# EAGLE design AzizCanHAMASOGLU (EAGLE 9.6.2)
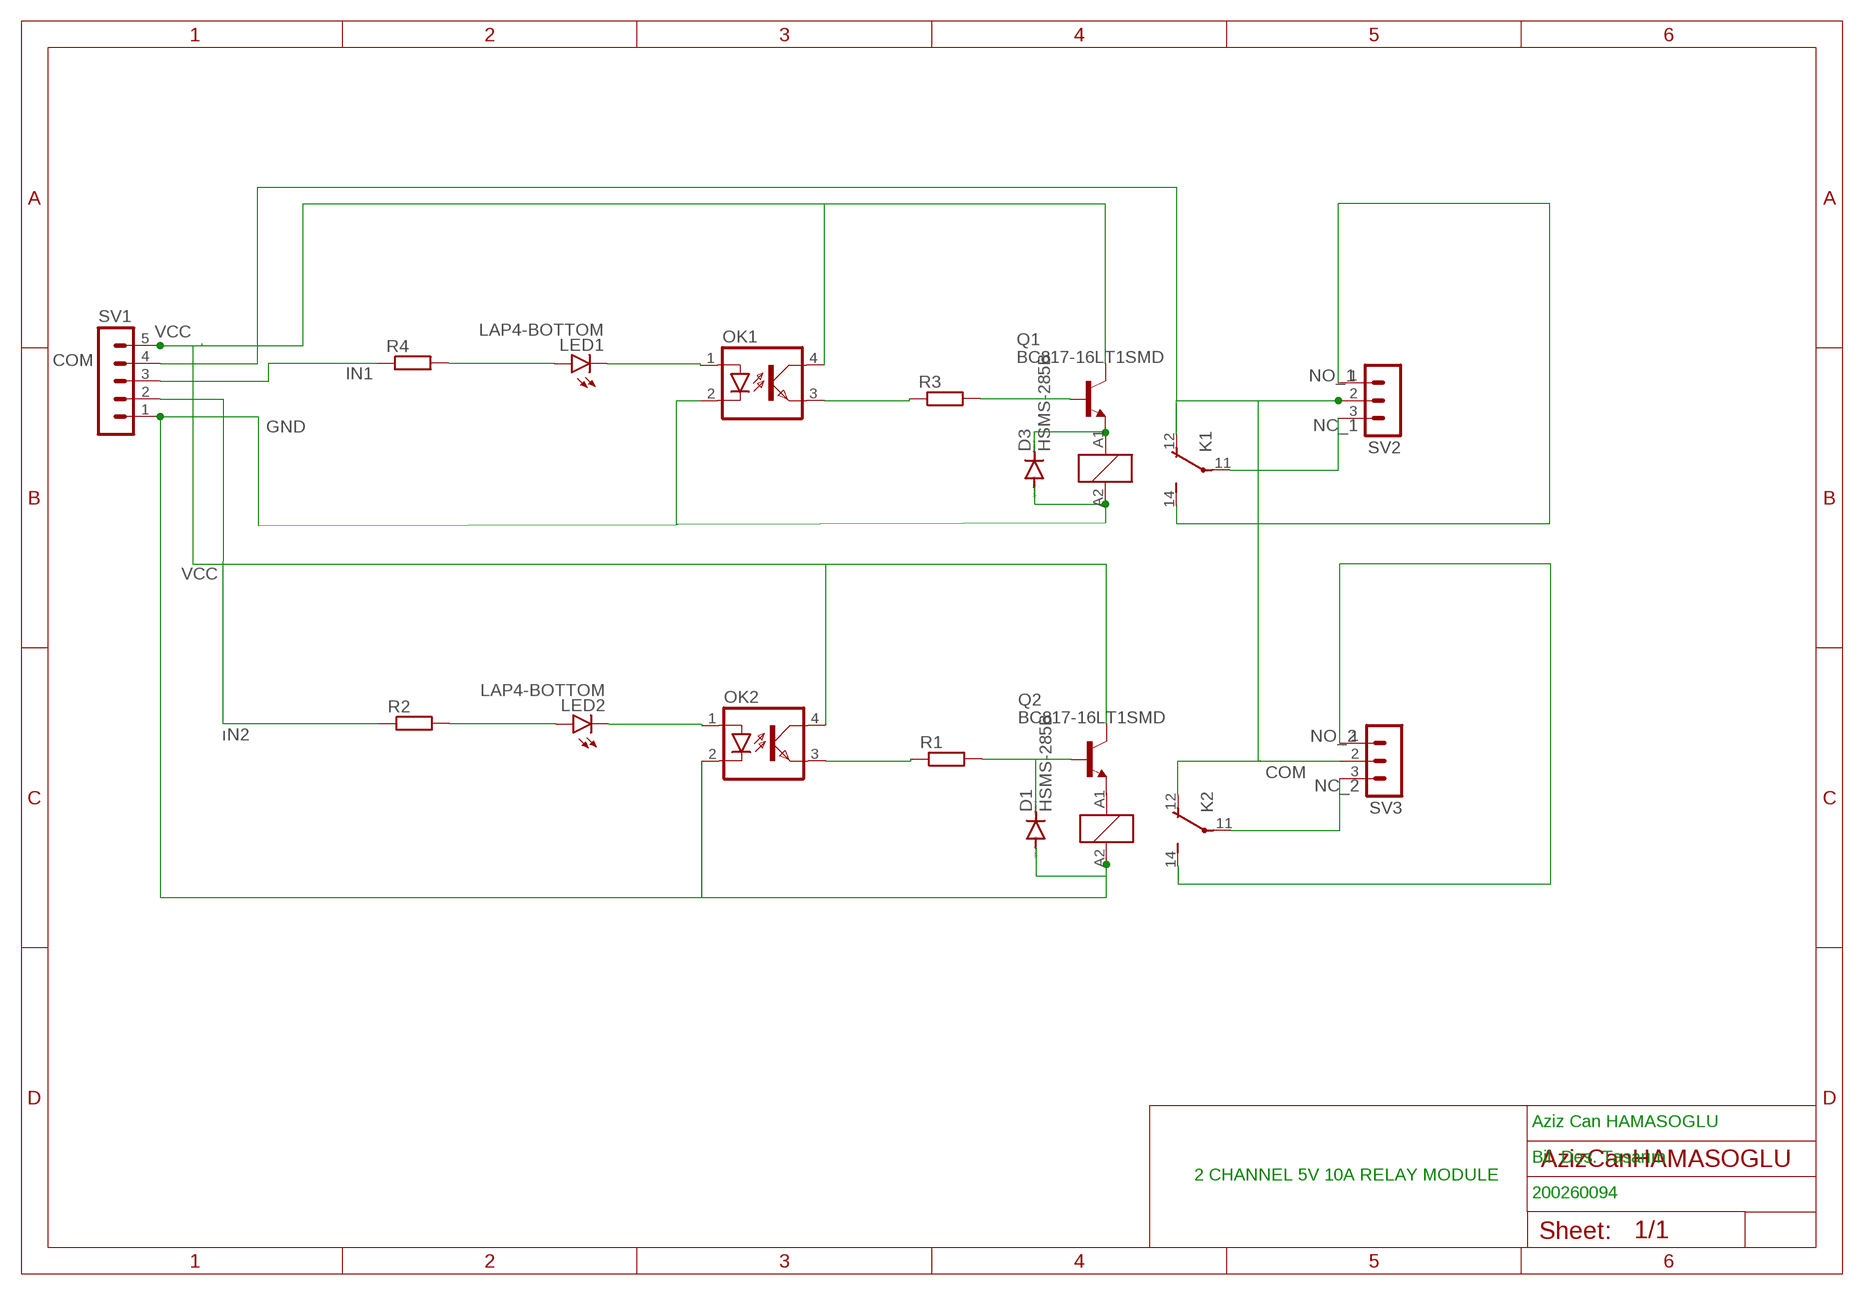
[diagram p0: schematic, sheet 1]

## Parts
D1  HSMS-285B  [SOT323]
D3  HSMS-285B  [SOT323]
K1  RY210005  [RY-II]
K2  RY210005  [RY-II]
LED1  LAP4-BOTTOM  [P47F-BOTTOM]
LED2  LAP4-BOTTOM  [P47F-BOTTOM]
OK1  PC817  [DIL04]
OK2  PC817  [DIL04]
Q1  BC817-16LT1SMD  [SOT23-BEC]
Q2  BC817-16LT1SMD  [SOT23-BEC]
R1  R-EU_M1206  [M1206]
R2  R-EU_M1206  [M1206]
R3  R-EU_M1206  [M1206]
R4  R-EU_M1206  [M1206]
SV1  MA05-1  [MA05-1]
SV2  MA03-1  [MA03-1]
SV3  MA03-1  [MA03-1]

## Nets
COM: K1.12(2:O) SV1.4 SV2.2 SV3.2
GND: D1.1(A) D3.1(A) K1.A2 K2.A2 OK1.2(C) OK2.2(C) SV1.1
IN1: R4.1 SV1.3
N$1: OK1.3(EMIT) R3.1
N$2: LED1.C OK1.1(A)
N$3: Q1.B R3.2
N$4: LED1.A R4.2
N$6: D3.3(C) K1.A1 Q1.E
N$7: OK2.3(EMIT) R1.1
N$8: D1.3(C) Q2.B R1.2
N$9: LED2.C OK2.1(A)
N$10: LED2.A R2.2
N$12: K2.12(2:O)
NC_1: K1.11(2:P) SV2.3
NC_2: K2.11(2:P) SV3.3
NO_1: K1.14(2:S) SV2.1
NO_2: K2.14(2:S) SV3.1
VCC: OK1.4(COL) OK2.4(COL) Q1.C Q2.C SV1.5
ıN2: R2.1 SV1.2
Unconnected: K2.A1 Q2.E

## Notes on the sheet
- Aziz Can HAMASOGLU
- Bil. Des. Tasarım
- 2 CHANNEL 5V 10A RELAY MODULE
- 200260094

## Library data of the parts
D1 D3 = avago:HSMS-285B: Surface Mount Microwave Schottky Detector Diodes Source: Data sheet <http://www.farnell.com/datasheets/461166.pdf>
K1 K2 = relay:RY?1*: Miniature Power PCB Relay SCHRACK 1 pole 8 A Source: http://www.schrack.com/.. 5817.pdf; MF: TYCO ELECTRONICS; MPN: RY210005; OC_FARNELL: unknown; OC_NEWARK: 08H3762
LED1 LED2 = led:*P4: PointLED® Enhanced Thinfilm LED TOP & BOTTOM mount LS P47F, LR P47F, LA P47F, LY P47F, LT P4SG, LB P4SG, LW P4SG Source: http://catalog.osram-os.com .. LA_LR_LS_LY_P47F_Pb_free.pdf
OK1 OK2 = optocoupler:PC817: SHARP OPTO COUPLER; MPN: PC817X4J000F; OC_FARNELL: 9707727; OC_NEWARK: 97K7059
Q1 Q2 = transistor-npn:BC817*: NPN Transistor
R1-R4 = rcl:R-EU_: RESISTOR, European symbol; SPICEPREFIX: R
SV1 = con-lstb:MA05-1: PIN HEADER; OC_FARNELL: unknown; OC_NEWARK: unknown
SV2 SV3 = con-lstb:MA03-1: PIN HEADER; OC_FARNELL: unknown; OC_NEWARK: unknown

## Board
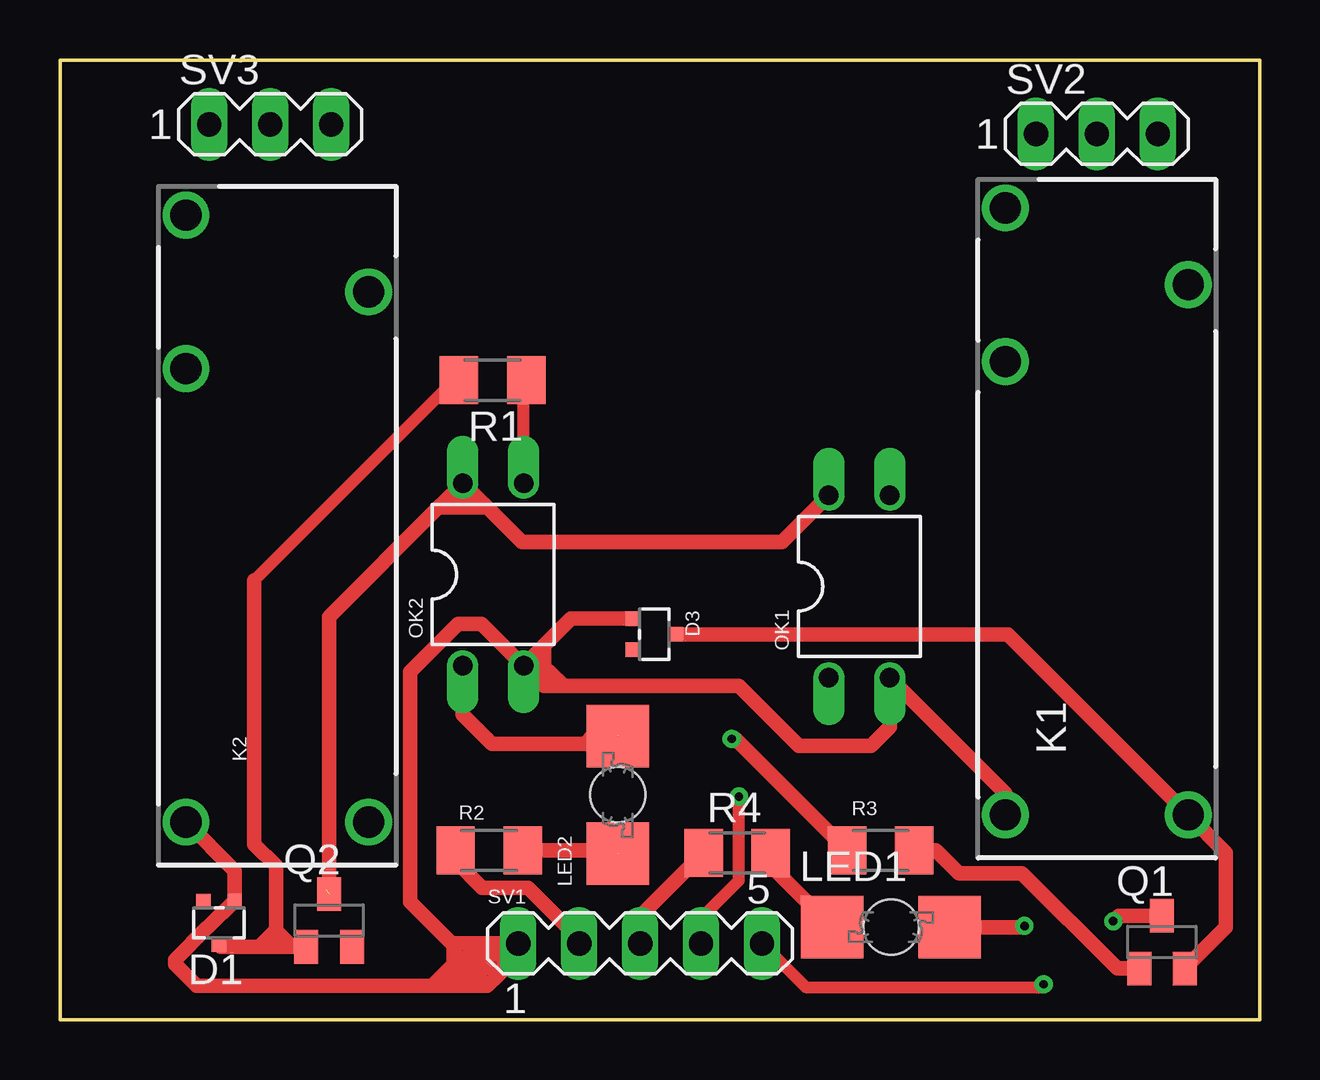
[diagram p1: board, top side]
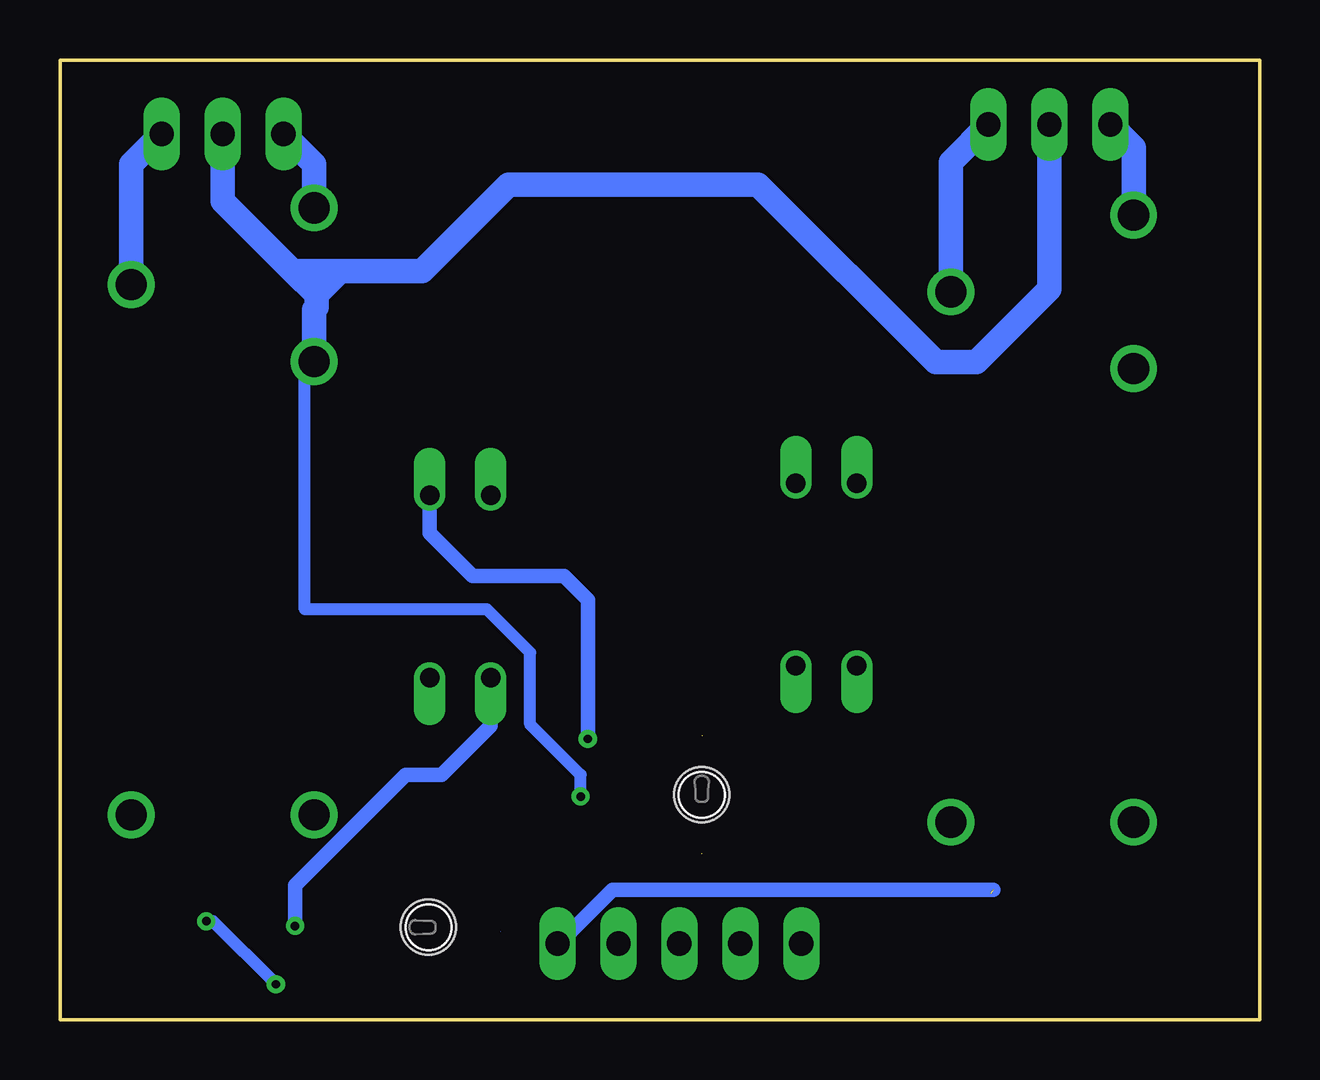
[diagram p2: board, bottom side, seen from below]

Size 50 x 40 mm. Coordinates in mm from the lower left corner, seen from the top.
Outline: 0,0 0,40 50,40 50,0 0,0
Copper layers (1*16): Top 0.035mm / dielectric 1.5mm / Bottom 0.035mm
Design rules "default": minimum track width 6mil, minimum drill 0.35mm, track to track 6mil, track to pad 6mil, pad to pad 6mil, via to via 6mil, smd to smd 6mil, copper to edge 40mil, drill to drill 6mil, minimum pad ring 10mil, minimum via ring 8mil, stop-mask expansion 4mil, vias tented up to drill 0mil, thermal gap 10mil

### Footprints (pad centres in the part's own frame; a part is rotated, then mirrored left to right if it is on the bottom)
SOT323 = smd 0.6 x 0.55: 1 -0.65,-0.925; 2 0.65,-0.925; 3 0,0.925
RY-II = drill 1.3: 11 9.4,-3.81; 12 6.2,3.81; 14 12.6,3.81; A1 -12.7,-3.81; A2 -12.7,3.81
P47F-BOTTOM = smd 2.6 x 2.6: A -2.45,0; C 2.45,0 | hole 2.3: 0,0
DIL04 = drill 0.813 offset: 1 -1.27,-3.81; 2 1.27,-3.81; 3 1.27,3.81; 4 -1.27,3.81
SOT23-BEC = smd 1 x 1.4: B -0.95,-1.1; C 0,1.1; E 0.95,-1.1
M1206 = smd 1.6 x 2: 1 -1.4,0; 2 1.4,0
MA05-1 = drill 1.016 long: 1 -5.08,0; 2 -2.54,0; 3 0,0; 4 2.54,0; 5 5.08,0
MA03-1 = drill 1.016 long: 1 -2.54,0; 2 0,0; 3 2.54,0

### Placement (x,y rotation side)
D1  6.63,4.03 180 top
D3  24.77,16.06 270 top
K1  43.22,21.23 90 top
K2  9.06,20.93 90 top
LED1  34.64,3.85 0 top
LED2  23.25,9.37 90 top
OK1  33.32,18.05 0 top
OK2  18.06,18.55 0 top
Q1  45.93,3.23 0 top
Q2  11.22,4.13 0 top
R1  18.03,26.65 180 top
R2  17.89,7.05 0 top
R3  34.21,7.05 0 top
R4  28.23,6.95 0 top
SV1  24.18,3.17 0 top
SV2  43.22,36.92 0 top
SV3  8.76,37.32 0 top

### Tracks (layer width: path | path; a pad name or v marks a point on that pad's centre or on a via)
COM  (via drill 0.35)
  Top 0.508: SV1.4 26.72,4.22 28.3,5.8 v28.3,9.3
  Bottom 0.508: v28.3,9.3 28.3,10.2 30.4,12.3 30.4,15.3 32.2,17.1 39.8,17.1 39.8,27.04 K1.12
  Bottom 1.016: SV2.2 43.22,34.12 40.3,31.2 | 40.3,31.2 38.32,31.2 | 38.32,31.2 34.9,31.2 31.3,34.8 20.9,34.8 13.5,27.4 11.8,27.4 8.76,30.44 SV3.2 | K1.12 39.41,29.6 39.31,29.7 39.31,30.21 | 39.31,30.21 40.3,31.2 | 38.32,31.2 39.31,30.21
GND
  Top 0.61: K1.A2 39.41,9.42 OK1.2 34.59,12.19 33.8,11.4 30.8,11.4 28.3,13.9 21,13.9 | OK2.2 20.17,13.9 | 20.17,13.9 21,13.9 | D3.1 21.3,16.71 20.09,15.51 | 20.09,15.51 19.64,15.05 | 19.64,15.05 OK2.2 | 20.17,13.9 20.17,14.53 | 20.17,14.53 19.64,15.05 | 20.17,14.53 20.17,15.43 20.09,15.51 | 20.17,14.53 20.37,14.53 21,13.9 | K2.A2 7.28,6.2 D1.1 6.16,3.84 6.14,3.84 4.8,2.5 4.8,2.3 5.7,1.4 15.5,1.4 | 15.5,1.4 16.7,1.4 | 16.7,1.4 17.1,1.4 | 17.1,1.4 17.5,1.4 | 17.5,1.4 17.8,1.4 18.25,1.85 | 18.25,1.85 18.5,2.1 | 18.5,2.1 18.9,2.5 | 18.9,2.5 19.1,2.7 SV1.1 18.2,3.17 | OK2.2 17.57,16.5 16.6,16.5 14.6,14.5 14.6,4.9 16.33,3.17 16.4,3.17 | 16.4,3.17 17,3.17 | 17,3.17 17.8,3.17 | 18.2,3.17 17.8,3.17 | 18.2,3.17 18.87,2.5 18.9,2.5 | 17.8,3.17 18.5,2.47 18.5,2.1 | 17.8,3.17 17.8,2.37 | 18.25,1.85 17.8,2.3 17.8,2.37 | 17,3.17 17.18,2.98 | 17.18,2.98 17.8,2.37 | 17.8,2.37 17.5,2.07 | 17.5,2.07 17.1,1.67 | 17.1,1.67 17.1,1.4 | 17.5,1.4 17.5,2.07 | 16.7,1.4 16.5,1.6 | 16.5,1.6 16.4,1.7 | 16.4,1.7 16.4,2.3 | 16.4,2.3 16.4,2.8 | 16.4,2.8 16.4,3.17 | 16.4,2.8 17.1,2.1 | 17.1,1.67 17.1,2.1 | 17.1,2.1 17.1,2.9 17.18,2.98 | 17.1,2.1 17,2.1 16.5,1.6 | 16.4,1.7 15.8,1.7 | 15.8,1.7 15.5,1.4 | 16.4,2.3 15.8,1.7
IN1
  Top 0.61: SV1.3 24.18,4.3 R4.1
N$1  (via drill 0.35)
  Top 0.61: R3.1 28.16,11.7 v28,11.7
  Bottom 0.61: v28,11.7 28,17.5 29,18.5 32.8,18.5 34.59,20.29 OK1.3
N$2  (via drill 0.35)
  Top 0.61: v40.2,3.9 40.15,3.85 LED1.C
  Bottom 0.61: v40.2,3.9 40.2,5.6 35.6,10.2 34.1,10.2 32.05,12.25 OK1.1
N$3
  Top 0.61: Q1.B 44.07,2.13 40.1,6.1 37.46,6.1 36.51,7.05 R3.2
N$4
  Top 0.61: LED1.A 29.63,6.41 R4.2
N$6
  Top 0.61: Q1.E 48.6,3.85 48.6,6.96 K1.A1 39.5,16.06 D3.3
N$7
  Top 0.508: OK2.3 19.33,26.55 R1.1
N$8
  Top 0.508: 8.1,18.3 16.45,26.65 R1.2
  Top 0.61: D1.3 6.71,3.03 8.3,3.03 | 8.3,3.03 9,3.03 | 9,3.03 9.67,3.03 | 9.67,3.03 Q2.B | 8.1,18.3 8.1,7.3 9,6.4 9,3.7 | 9,3.03 9,3.7 | 9,3.7 9.67,3.03 | 9,3.7 8.97,3.7 8.3,3.03
N$9  (1 unrouted)
  Top 0.61: OK2.1 16.79,12.71 18,11.5 21.89,11.5 22.23,11.84 23.25,11.84
N$10  (1 unrouted)
  Top 0.61: R2.2 22.08,7.05 22.23,6.9 23.25,6.9
NC_1
  Bottom 1.016: K1.11 47.03,35.65 SV2.3
NC_2
  Bottom 1.016: K2.11 12.87,35.75 SV3.3
NO_1
  Bottom 1.016: K1.14 39.41,35.65 SV2.1
NO_2
  Bottom 1.016: K2.14 5.25,36.35 SV3.1
VCC  (via drill 0.35)  (1 unrouted)
  Top 0.508: SV1.5 31.08,1.35 41,1.35 v41,1.47
  Top 0.61: 17.43,21.73 OK2.4 16.11,21.68 | 17.43,21.73 17.82,21.34 | 17.82,21.34 19.25,19.9 30.09,19.9 OK1.4 | Q2.C 11.22,16.79 15.77,21.34 | 15.77,21.34 16.11,21.68 | 16.11,21.68 17.39,21.68 17.43,21.73 | 15.77,21.34 17.82,21.34 | Q1.C 44.13,4.33 v43.9,4.1
  Bottom 0.508: v41,1.47 43.63,4.1 v43.9,4.1
  Bottom 0.61: SV1.5 29.21,3.17 26.98,5.4 11.1,5.4
ıN2
  Top 0.61: SV1.2 21.64,3.36 19.5,5.5 17.6,5.5 16.49,6.61 R2.1